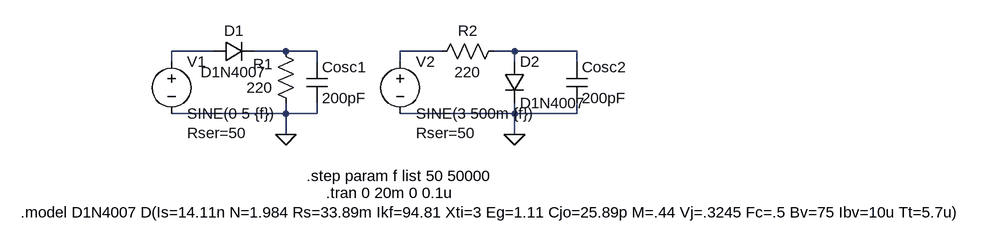
[diagram p0: schematic diodo1.asc]
diodo1.asc, the LTspice schematic file:
Version 4
SHEET 1 1184 680
WIRE 192 128 128 128
WIRE 304 128 256 128
WIRE 352 128 304 128
WIRE 544 128 480 128
WIRE 656 128 624 128
WIRE 752 128 656 128
WIRE 128 144 128 128
WIRE 352 144 352 128
WIRE 480 144 480 128
WIRE 656 144 656 128
WIRE 752 144 752 128
WIRE 304 224 304 208
WIRE 304 224 128 224
WIRE 352 224 352 208
WIRE 352 224 304 224
WIRE 656 224 656 208
WIRE 656 224 480 224
WIRE 752 224 752 208
WIRE 752 224 656 224
WIRE 304 256 304 224
WIRE 656 256 656 224
FLAG 304 256 0
FLAG 656 256 0
SYMBOL res 320 224 R180
WINDOW 0 36 76 Left 0
WINDOW 3 36 40 Left 0
SYMATTR InstName R1
SYMATTR Value 220
SYMBOL voltage 128 128 R0
WINDOW 123 0 0 Left 0
WINDOW 39 24 126 Left 0
SYMATTR InstName V1
SYMATTR Value SINE(0 5 {f})
SYMATTR SpiceLine Rser=50
SYMBOL diode 192 144 R270
WINDOW 0 32 32 VTop 0
WINDOW 3 0 32 VBottom 0
SYMATTR InstName D1
SYMATTR Value D1N4007
SYMBOL res 528 144 R270
WINDOW 0 32 56 VTop 0
WINDOW 3 0 56 VBottom 0
SYMATTR InstName R2
SYMATTR Value 220
SYMBOL voltage 480 128 R0
WINDOW 123 0 0 Left 0
WINDOW 39 24 126 Left 0
SYMATTR InstName V2
SYMATTR Value SINE(3 500m {f})
SYMATTR SpiceLine Rser=50
SYMBOL diode 640 144 R0
SYMATTR InstName D2
SYMATTR Value D1N4007
SYMBOL cap 336 144 R0
SYMATTR InstName Cosc1
SYMATTR Value 200pF
SYMBOL cap 736 144 R0
SYMATTR InstName Cosc2
SYMATTR Value 200pF
TEXT 336 320 Left 0 !.step param f list 50 50000
TEXT 366 346 Left 0 !.tran 0 20m 0 0.1u
TEXT -104 376 Left 0 !.model D1N4007 D(Is=14.11n N=1.984 Rs=33.89m Ikf=94.81 Xti=3 Eg=1.11 Cjo=25.89p M=.44 Vj=.3245 Fc=.5 Bv=75 Ibv=10u Tt=5.7u)

The netlist it stands for:
* diodo1.asc
R1 0 N002 220
V1 N001 0 SINE(0 5 {f}) Rser=50
D1 N001 N002 D1N4007
R2 N003 N004 220
V2 N003 0 SINE(3 500m {f}) Rser=50
D2 N004 0 D1N4007
Cosc1 N002 0 200pF
Cosc2 N004 0 200pF
.model D D
.lib standard.dio
.step param f list 50 50000
.tran 0 20m 0 0.1u
.model D1N4007 D(Is=14.11n N=1.984 Rs=33.89m Ikf=94.81 Xti=3 Eg=1.11 Cjo=25.89p M=.44 Vj=.3245 Fc=.5 Bv=75 Ibv=10u Tt=5.7u)
.backanno
.end